# Altium project LaserDiode_Analog.PrjPcb (part 1 of 2)
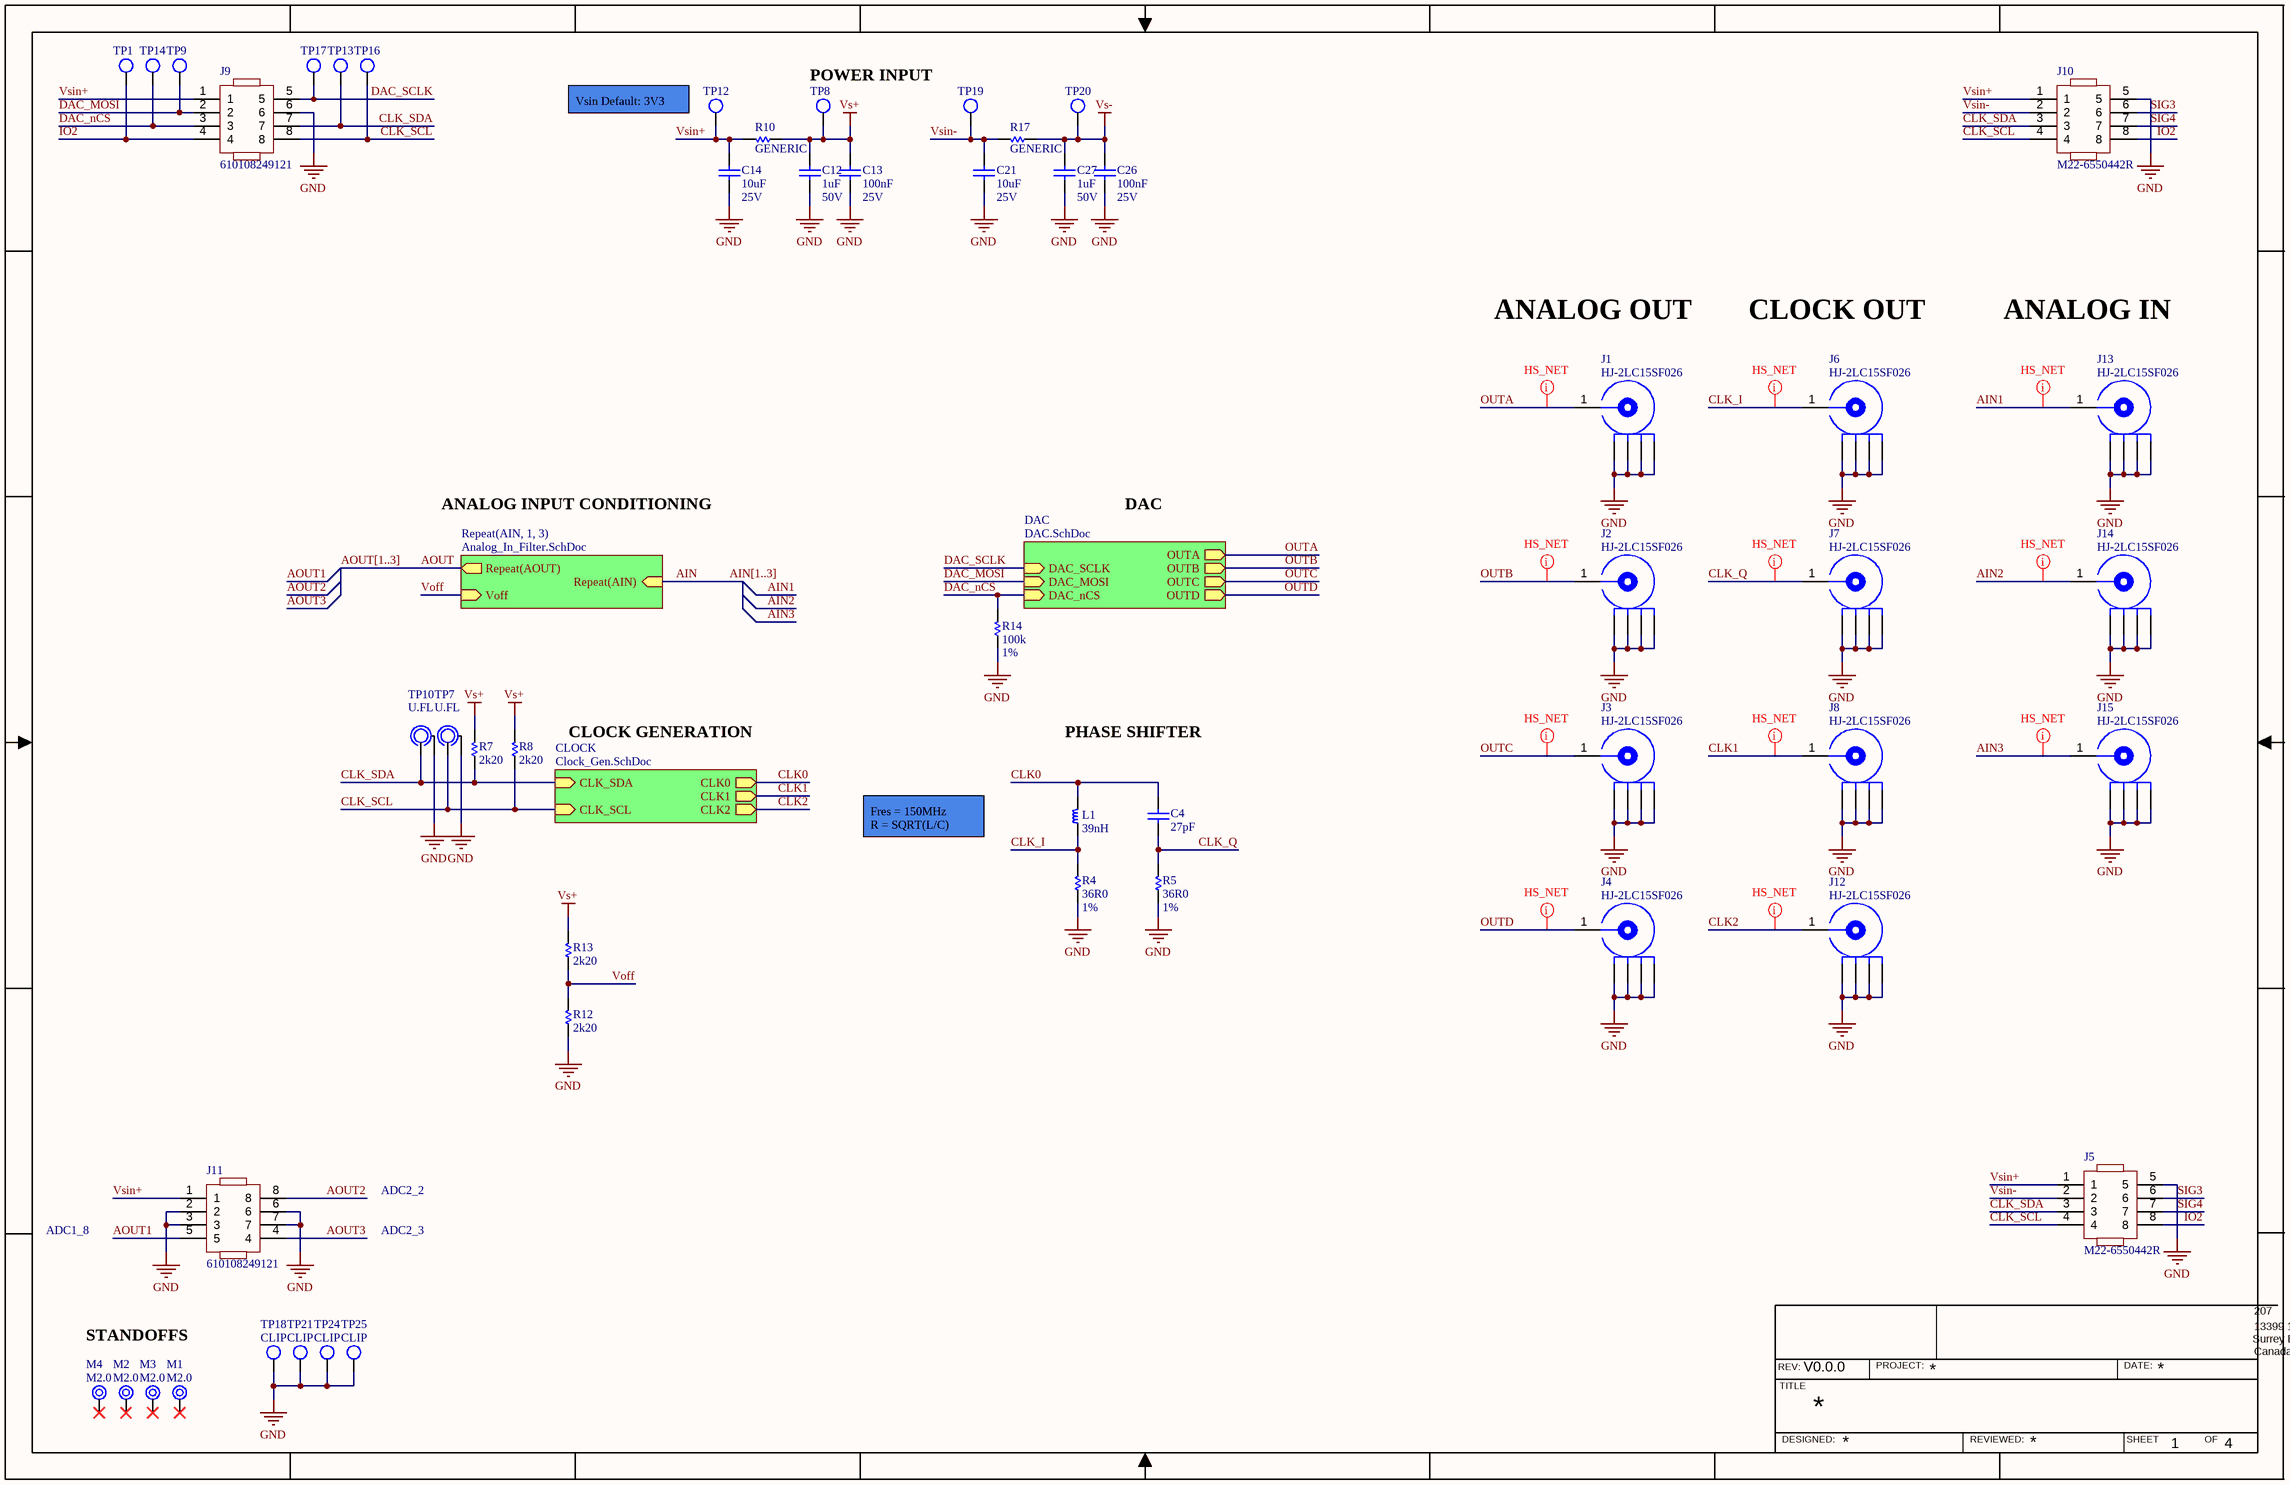
[diagram p0: LaserDiode_Analog.SchDoc]
4 sheets, 133 parts. Net scope: hierarchical (ports join the sheet entries above them; power ports are global).
Board file: LaserDiode_Analog.PcbDoc
Sheets:
  LaserDiode_Analog.SchDoc
    DAC = DAC.SchDoc
    AIN1 = Analog_In_Filter.SchDoc
    AIN2 = Analog_In_Filter.SchDoc
    AIN3 = Analog_In_Filter.SchDoc
    CLOCK = Clock_Gen.SchDoc

## Sheet LaserDiode_Analog.SchDoc
size 431 x 279 mm; Organization: ORGANIZATION; Address1: 207; Address2: 13399 104 Ave; Address3: Surrey BC, V3T 0C9; Address4: Canada; Revision: V0.0.0; SheetNumber: 1; SheetTotal: 4; ENG_APP_DATE: --/--/--; DSN_APP_DATE: --/--/--; CHK_APP_DATE: --/--/--

### Parts
C4  27pF  [C0402]
C12  1uF  Voltage Rating: 50V  [c0603]
C13  100nF  Voltage Rating: 25V  [C0402]
C14  10uF  Voltage Rating: 25V  [c0805]
C21  10uF  Voltage Rating: 25V  [c0805]
C26  100nF  Voltage Rating: 25V  [C0402]
C27  1uF  Voltage Rating: 50V  [c0603]
J1  HJ-2LC15SF026  [SMA TH RA BORE]
J2  HJ-2LC15SF026  [SMA TH RA BORE]
J3  HJ-2LC15SF026  [SMA TH RA BORE]
J4  HJ-2LC15SF026  [SMA TH RA BORE]
J5  M22-6550442R  [CONN HDR 08 FEMALE RA 2ROW]
J6  HJ-2LC15SF026  [SMA TH RA BORE]
J7  HJ-2LC15SF026  [SMA TH RA BORE]
J8  HJ-2LC15SF026  [SMA TH RA BORE]
J9  610108249121  [CONN HDR 08 MALE RA 2ROW - duplicate]
J10  M22-6550442R  [CONN HDR 08 FEMALE RA 2ROW]
J11  610108249121  [CONN HDR 08 MALE RA 2ROW - duplicate]
J12  HJ-2LC15SF026  [SMA TH RA BORE]
J13  HJ-2LC15SF026  [SMA TH RA BORE]
J14  HJ-2LC15SF026  [SMA TH RA BORE]
J15  HJ-2LC15SF026  [SMA TH RA BORE]
L1  39nH  [L0402]
M1  M2.0  [MECH M2.0 UNPLATED]  (no BOM)
M2  M2.0  [MECH M2.0 UNPLATED]  (no BOM)
M3  M2.0  [MECH M2.0 UNPLATED]  (no BOM)
M4  M2.0  [MECH M2.0 UNPLATED]  (no BOM)
R4  36R0  Tolerance: 1%  [R0402]
R5  36R0  Tolerance: 1%  [R0402]
R7  2k20  [R0402]
R8  2k20  [R0402]
R10  GENERIC  [R0603]
R12  2k20  [R0402]
R13  2k20  [R0402]
R14  100k  Tolerance: 1%  [r0402]
R17  GENERIC  [R0603]
TP1  1mm  [TESTPOINT_SMT]  (value not drawn)  (no BOM)
TP7  U.FL  [U.FL]
TP8  1mm  [TESTPOINT_SMT]  (value not drawn)  (no BOM)
TP9  1mm  [TESTPOINT_SMT]  (value not drawn)  (no BOM)
TP10  U.FL  [U.FL]
TP12  1mm  [TESTPOINT_SMT]  (value not drawn)  (no BOM)
TP13  1mm  [TESTPOINT_SMT]  (value not drawn)  (no BOM)
TP14  1mm  [TESTPOINT_SMT]  (value not drawn)  (no BOM)
TP16  1mm  [TESTPOINT_SMT]  (value not drawn)  (no BOM)
TP17  1mm  [TESTPOINT_SMT]  (value not drawn)  (no BOM)
TP18  CLIP  [TESTPOINT_CLIP_1206]
TP19  1mm  [TESTPOINT_SMT]  (value not drawn)  (no BOM)
TP20  1mm  [TESTPOINT_SMT]  (value not drawn)  (no BOM)
TP21  CLIP  [TESTPOINT_CLIP_1206]
TP24  CLIP  [TESTPOINT_CLIP_1206]
TP25  CLIP  [TESTPOINT_CLIP_1206]

### Sub-sheets
CLOCK = Clock_Gen.SchDoc: CLK0 (out), CLK1 (out), CLK2 (out), CLK_SCL (in), CLK_SDA (in)
DAC = DAC.SchDoc: OUTA (out), OUTB (out), OUTC (out), OUTD (out), DAC_SCLK (in), DAC_MOSI (in), DAC_nCS (in)
Repeat(AIN, 1, 3) = Analog_In_Filter.SchDoc: Repeat(AOUT) (out), Repeat(AIN) (in), Voff (in)

### Nets
GND: C12.1 C13.1 C14.1 C21.1 C26.1 C27.1 J1.0 J2.0 J3.0 J4.0 J5.5 J6.0 J7.0 J8.0 J9.6 J10.5 J11.2 J11.3 J11.6 J11.7 J12.0 J13.0 J14.0 J15.0 R4.1 R5.1 R12.1 R14.1 TP7.0 TP10.0 TP18.1 TP21.1 TP24.1 TP25.1
Vs+: C12.2 C13.2 R7.2 R8.2 R10.1 R13.2 TP8.1
Vs-: C26.2 C27.2 R17.1 TP20.1
AIN: sheet Repeat(AIN, 1, 3)/Repeat(AIN)
AIN1: J13.1
AIN2: J14.1
AIN3: J15.1
AOUT: sheet Repeat(AIN, 1, 3)/Repeat(AOUT)
AOUT1: J11.5
AOUT2: J11.8
AOUT3: J11.4
CLK0: C4.2 L1.1 ; sheet CLOCK/CLK0
CLK1: J8.1 ; sheet CLOCK/CLK1
CLK2: J12.1 ; sheet CLOCK/CLK2
CLK_I: J6.1 L1.2 R4.2
CLK_Q: C4.1 J7.1 R5.2
CLK_SCL: J5.4 J9.8 J10.4 R8.1 TP7.1 TP16.1 ; sheet CLOCK/CLK_SCL
CLK_SDA: J5.3 J9.7 J10.3 R7.1 TP10.1 TP13.1 ; sheet CLOCK/CLK_SDA
DAC_MOSI: J9.2 TP9.1 ; sheet DAC/DAC_MOSI
DAC_nCS: J9.3 R14.2 TP14.1 ; sheet DAC/DAC_nCS
DAC_SCLK: J9.5 TP17.1 ; sheet DAC/DAC_SCLK
IO2: J5.8 J9.4 J10.8 TP1.1
OUTA: J1.1 ; sheet DAC/OUTA
OUTB: J2.1 ; sheet DAC/OUTB
OUTC: J3.1 ; sheet DAC/OUTC
OUTD: J4.1 ; sheet DAC/OUTD
SIG3: J5.6 J10.6
SIG4: J5.7 J10.7
Voff: R12.2 R13.1 ; sheet Repeat(AIN, 1, 3)/Voff
Vsin+: C14.2 J5.1 J9.1 J10.1 J11.1 R10.2 TP12.1
Vsin-: C21.2 J5.2 J10.2 R17.2 TP19.1

Not connected (* = marked no-connect by the designer): M1 1*; M2 1*; M3 1*; M4 1*

### Buses and harness runs
bus AIN[1..3]
bus AOUT[1..3]

### Layout directives
net class HS_NET; rule Clearance Constraint [Generic clearance = 10mil, and 30 value(s) for objects]; rule Impedance Constraint [Min = 42.50    Max = 57.50    ]: AIN1, AIN2, AIN3, CLK1, CLK2, CLK_I, CLK_Q, OUTA, OUTB, OUTC, OUTD

### Notes on the sheet
- (near TP8) POWER INPUT
- (near TP12) Vsin Default: 3V3
- ANALOG OUT
- CLOCK OUT
- ANALOG IN
- ANALOG INPUT CONDITIONING
- DAC
- CLOCK GENERATION
- PHASE SHIFTER
- Fres = 150MHz
  R = SQRT(L/C)
- ADC1_8
- ADC2_2
- ADC2_3
- STANDOFFS
- REV:
- PROJECT:
- DATE:
- TITLE
- SHEET
- OF
- DESIGNED:
- REVIEWED:

### Library data of the parts
C4 = CAP CER 27pF 50V C0G 0402: 贴片陶瓷电容  27pF ±5% 50V C0G(NP0) 0402; Manufacturer: Samsung; Manufacturer Part Number: CL05C270JB5NNNC; Material: Ceramic; Temperature Coefficient: 300ppm/°C; Supplier 1: RSComponents; RoHS: Yes; Category: Ceramic Capacitors; Stock 1: 1; Pricing 1: 10000=0.00700, 30000=0.00700, 50000=0.00500, 100000=0.00500, 250000=0.00400 (USD); Mount: Surface Mount; Case/Package: 0402; Case Code (Metric): 1005; Case Code (Imperial): 0402; Contact Plating: Tin; Min Operating Temperature: -55°C; Max Operating Temperature: 125°C; Capacitance: 27pF; Tolerance: 5%; Packaging: Tape and Reel; Package Quantity: 1; Voltage Rating: 50V; Dielectric: C0G; Voltage: 50V; Series: CL; Voltage Rating (DC): 50V; Length: 1mm; Width: 0.02inch; Height: 0.5mm; Thickness: 0.022inch; Depth: 0.5mm; Radiation Hardening: No; RoHS Compliant: Yes; Lead Free: Lead Free; ComponentLink1URL: https://datasheet.ciiva.com/25806/cl05c270jb5nnnc-25806401.pdf?src-supplier=Digi-Key; ComponentLink1Description: https://datasheet.ciiva.com/25806/cl05c270jb5nnnc-25806401.pdf?src-supplier=Digi-Key; ComponentLink2URL: https://datasheet.ciiva.com/26838/getdatasheetpartid-359687-26838295.pdf?src-supplier=Verical; ComponentLink2Description: https://datasheet.ciiva.com/26838/getdatasheetpartid-359687-26838295.pdf?src-supplier=Verical; ComponentLink3URL: https://datasheet.ciiva.com/29198/458634-da-01-en-vs-kondensator-0402-29198410.pdf?src-supplier=Conrad; ComponentLink3Description: https://datasheet.ciiva.com/29198/458634-da-01-en-vs-kondensator-0402-29198410.pdf?src-supplier=Conrad; ComponentLink4URL: https://datasheet.ciiva.com/16391/cl05b104kq5nnnc-16391291.pdf?src-supplier=Future+Electronics; ComponentLink4Description: https://datasheet.ciiva.com/16391/cl05b104kq5nnnc-16391291.pdf?src-supplier=Future+Electronics; Supplier Part Number 1: 7661429
C12 C27 = CAP CER 1uF 50V X5R 0603: Multilayer Ceramic Capacitors (High dielectric type), 50V, 1 uF, ± 10 %, 0603, X5R, RoHS; Manufacturer: Taiyo Yuden; Manufacturer Part Number: UMK107BJ105KA-T; Tolerance: 10%; Supplier 1: Digi-Key; RoHS: Yes; Category: Ceramic Capacitors; Stock 1: 955108; Pricing 1: 1=0.19000, 10=0.12900, 50=0.07760, 100=0.06560, 500=0.04484, 1000=0.03968 (USD); Mount: Surface Mount; Case/Package: 0603; Number of Pins: 2; Case Code (Metric): 1608; Case Code (Imperial): 0603; Contact Plating: Nickel; Min Operating Temperature: -55°C; Max Operating Temperature: 85°C; Capacitance: 1uF; Packaging: Tape and Reel; Package Quantity: 1; Dielectric: X5R; Voltage Rating (DC): 50V; Termination: SMD/SMT; Series: M; Construction: Flat; Length: 1.6mm; Width: 0.031inch; Height: 0.8mm; Depth: 0.8mm; Thickness: 0.035inch; Radiation Hardening: No; RoHS Compliant: Yes; REACH SVHC: Unknown; Halogen Free: Halogen Free; ComponentLink1URL: https://datasheet.ciiva.com/134/umk107bj105ka-t-ss-134740.pdf?src-supplier=Digi-Key; ComponentLink1Description: https://datasheet.ciiva.com/134/umk107bj105ka-t-ss-134740.pdf?src-supplier=Digi-Key; ComponentLink2URL: https://datasheet.ciiva.com/11601/umk107bj105ka-t-ss-11601811.pdf?src-supplier=Avnet; ComponentLink2Description: https://datasheet.ciiva.com/11601/umk107bj105ka-t-ss-11601811.pdf?src-supplier=Avnet; ComponentLink3URL: https://datasheet.ciiva.com/5744/1697715-5744913.pdf?src-supplier=Farnell; ComponentLink3Description: https://datasheet.ciiva.com/5744/1697715-5744913.pdf?src-supplier=Farnell; ComponentLink4URL: https://datasheet.ciiva.com/30199/43umk107bj105ka-t-30199791.pdf?src-supplier=Onlinecomponents.com; ComponentLink4Description: https://datasheet.ciiva.com/30199/43umk107bj105ka-t-30199791.pdf?src-supplier=Onlinecomponents.com; ComponentLink5URL: https://datasheet.ciiva.com/15922/336umk107bj105ka-t-15922611.pdf?src-supplier=Onlinecomponents.com; ComponentLink5Description: https://datasheet.ciiva.com/15922/336umk107bj105ka-t-15922611.pdf?src-supplier=Onlinecomponents.com; ComponentLink6URL: https://datasheet.ciiva.com/5427/mlcc-all-e-541559-5427036.pdf?src-supplier=Mouser; ComponentLink6Description: https://datasheet.ciiva.com/5427/mlcc-all-e-541559-5427036.pdf?src-supplier=Mouser; ComponentLink7URL: https://datasheet.ciiva.com/7975/mlcc-all-e-7975898.pdf?src-supplier=Element14; ComponentLink7Description: https://datasheet.ciiva.com/7975/mlcc-all-e-7975898.pdf?src-supplier=Element14; ComponentLink8URL: https://datasheet.ciiva.com/7975/1697715-7975608.pdf?src-supplier=Element14; ComponentLink8Description: https://datasheet.ciiva.com/7975/1697715-7975608.pdf?src-supplier=Element14; ComponentLink9URL: https://datasheet.ciiva.com/22694/1697715-22694278.pdf?src-supplier=Element14; ComponentLink9Description: https://datasheet.ciiva.com/22694/1697715-22694278.pdf?src-supplier=Element14; Supplier Part Number 1: 587-2400-1-ND
C13 C26 = CAP CER 100nF 25V X5R 0402: Cap Ceramic 0.1uF 25V X5R 10% Pad SMD 0402 85¡ãC T/R / Multi Layer Ceramic Capacitor (MLCC); Manufacturer: Samsung; Manufacturer Part Number: CL05A104KA5NNNC; Supplier 1: Digi-Key; RoHS: Yes; Category: Ceramic Capacitors; Stock 1: 8053194; Pricing 1: 1=0.10000, 10=0.01100, 50=0.00600, 100=0.00490, 500=0.00346, 1000=0.00272, 2500=0.00248, 5000=0.00228 (USD); Mount: Surface Mount; Case/Package: 0402; Case Code (Metric): 1005; Case Code (Imperial): 0402; Min Operating Temperature: -55°C; Max Operating Temperature: 85°C; Capacitance: 100nF; Tolerance: 10%; Dielectric: X5R; Packaging: Tape and Reel; Package Quantity: 1; Voltage: 25V; Series: CL; Construction: Flat; Voltage Rating (DC): 25V; Length: 1mm; Width: 0.02inch; Height: 0.5mm; Thickness: 0.022inch; Depth: 0.5mm; Radiation Hardening: No; Lead Free: Lead Free; ComponentLink1URL: https://datasheet.ciiva.com/25802/cl05a104ka5nnnc-25802704.pdf?src-supplier=Digi-Key; ComponentLink1Description: https://datasheet.ciiva.com/25802/cl05a104ka5nnnc-25802704.pdf?src-supplier=Digi-Key; ComponentLink2URL: https://datasheet.ciiva.com/26838/getdatasheetpartid-357412-26838142.pdf?src-supplier=Verical; ComponentLink2Description: https://datasheet.ciiva.com/26838/getdatasheetpartid-357412-26838142.pdf?src-supplier=Verical; ComponentLink3URL: https://datasheet.ciiva.com/16437/cl05a104ka5nnnc-16437369.pdf?src-supplier=Future+Electronics; ComponentLink3Description: https://datasheet.ciiva.com/16437/cl05a104ka5nnnc-16437369.pdf?src-supplier=Future+Electronics; ComponentLink4URL: https://datasheet.ciiva.com/26309/mlcc-catalogdownload2013-eng-26309014.pdf?src-supplier=Distrelec; ComponentLink4Description: https://datasheet.ciiva.com/26309/mlcc-catalogdownload2013-eng-26309014.pdf?src-supplier=Distrelec; Supplier Part Number 1: 1276-1043-1-ND
C14 C21 = CAP CER 10uF 25V X5R 0805: Cap Ceramic 10uF 25V X5R 10% SMD 0805 85°C Embossed T/R; Manufacturer: Samsung; Manufacturer Part Number: CL21A106KAYNNNE; Supplier 1: Digi-Key; RoHS: Yes; Category: Ceramic Capacitors; Stock 1: 2266338; Pricing 1: 2000=0.03549, 4000=0.03247 (USD); Mount: Surface Mount; Case/Package: 0805; Case Code (Metric): 2012; Case Code (Imperial): 0805; Min Operating Temperature: -55°C; Max Operating Temperature: 85°C; Package Quantity: 1; Packaging: Tape and Reel; Capacitance: 10uF; Tolerance: 10%; Dielectric: X5R; Series: CL; Construction: Flat; Length: 2mm; Width: 0.049inch; Height: 1.25mm; Depth: 1.25mm; Thickness: 0.057inch; Radiation Hardening: No; RoHS Compliant: Yes; ComponentLink1URL: https://datasheet.ciiva.com/25796/cl21a106kaynnne-25796720.pdf?src-supplier=Digi-Key; ComponentLink1Description: https://datasheet.ciiva.com/25796/cl21a106kaynnne-25796720.pdf?src-supplier=Digi-Key; ComponentLink2URL: https://datasheet.ciiva.com/26838/getdatasheetpartid-357558-26838583.pdf?src-supplier=Verical; ComponentLink2Description: https://datasheet.ciiva.com/26838/getdatasheetpartid-357558-26838583.pdf?src-supplier=Verical; Supplier Part Number 1: 1276-2891-2-ND
J1-J4 J6-J8 J12-J15 = CON SMA BORE SMD RA HJ-2LC15SF026
J5 J10 = CONN HDR 08 FEMALE RA 2 ROW: Conn Socket Strip RCP 8 POS 2mm Solder RA SMD T/R; Manufacturer: Harwin; Connector Type: Receptacle,Forked; Number of Positions: 8; Current Rating: 2A; Supplier 1: Newark; Manufacturer Part Number: M22-6550442R; RoHS: Yes; Category: Connectors; Stock 1: 750; Pricing 1: 1=1.17000, 100=0.91900, 250=0.84000, 500=0.76600, 1000=0.71200 (USD); Mount: Surface Mount; Contact Plating: Gold; Contact Material: Bronze; Insulation Color: Black; Insulation Material: Polymer; Contact Shape: Square; Min Operating Temperature: -40°C; Max Operating Temperature: 105°C; Fastening Type: Push,Pull; Packaging: Cut Tape; Number of Rows: 2; Termination: Solder; Flammability Rating: UL94 V-0; RoHS Compliant: Yes; ComponentLink1URL: https://cdn.harwin.com/pdfs/M22-655R.pdf?src-supplier=Digi-Key; ComponentLink1Description: https://cdn.harwin.com/pdfs/M22-655R.pdf?src-supplier=Digi-Key; Supplier Part Number 1: 45AJ6425
J9 J11 = CONN HDR 08 MALE RA 2 ROW: SMT Angled Pin Header WR-PHD, Pitch 2.54 mm, Dual Row, 8 pins; Manufacturer: Wurth Electronics; Current Rating: 3A; Number of Positions: 8; Gender: Male; Voltage Rating: 250V; Pitch: 0.1inch; Supplier 1: Newark; Manufacturer Part Number: 610108249121; RoHS: Yes; Category: Connectors; Stock 1: 350; Pricing 1: 1=1.53000, 10=1.52000, 25=1.49000, 50=1.46000, 100=1.36000 (USD); Mount: Surface Mount; Number of Pins: 8; Contact Material: Copper Alloy; Color: Black; Contact Plating: Gold; Contact Shape: Square; Contact Finish - Mating: GOLD; Insulation Material: Nylon; Insulation Color: Black; Packaging: Cut Tape; Number of Rows: 2; Termination: Solder; Number of Contacts: 8; Connector Type: Header; Fastening Type: Pull; Series: WR-PHD; Contact Type: Male Pin; Row Spacing: 0.1inch; Contact Mating Length: 0.236inch; RoHS Compliant: Yes; Flammability Rating: UL94 V-0; ComponentLink1URL: http://www.farnell.com/cad/1889791.pdf?src-supplier=Element14; ComponentLink1Description: http://www.farnell.com/cad/1889791.pdf?src-supplier=Element14; ComponentLink2URL: https://katalog.we-online.de/em/datasheet/6101xx249121.pdf?src-supplier=Digi-Key; ComponentLink2Description: https://katalog.we-online.de/em/datasheet/6101xx249121.pdf?src-supplier=Digi-Key; ComponentLink3URL: https://www.distrelec.bizhttp://katalog.we-online.de/em/datasheet/6101xx249121.pdf?mime=application%2Fpdf&src-supplier=Distrelec; ComponentLink3Description: https://www.distrelec.bizhttp://katalog.we-online.de/em/datasheet/6101xx249121.pdf?mime=application%2Fpdf&src-supplier=Distrelec; Supplier Part Number 1: 72Y1215
L1 = IND HF 39nH 5% 150mA 1R2 0402: Inductor RF Chip Multi-Layer 0.039uH 5% 100MHz 8Q-Factor Ceramic 0.15A 1.2Ohm DCR 0402 T/R; Manufacturer 1: Johanson; Manufacturer Part Number 1: L-07C39NJV6T; Category 1: Fixed Inductors; Shielding: Unshielded; Q Factor: 8; Current Rating: 150mA; DC Resistance (DCR): 1.2R; Self Resonant Frequency: 1.4GHz; Supplier 1: Arrow Electronics; Supplier Part Number 1: L-07C39NJV6T; RoHS 1: Yes; Description 1: Inductor RF Chip Multi-Layer 0.039uH 5% 100MHz 8Q-Factor Ceramic 0.15A 1.2Ohm DCR 0402 T/R; Stock 1: 27840; Pricing 1: 1=0.09800, 10=0.04660, 25=0.04150, 100=0.03100, 250=0.02700, 500=0.02460, 1000=0.02080, 3000=0.01830, 6000=0.01810, 15000=0.01450 (USD); Mounting Technology: Surface Mount; Case/Package: 0402; Pins: 2; Case Code (Metric): 1005; Case Code (Imperial): 0402; Core Material: Ceramic; Min Operating Temperature: -40°C; Max Operating Temperature: 100°C; Tolerance: 5%; Packaging: Tape and Reel; Package Quantity: 1; Inductance Tolerance: 5%; Value: 39nH; Max DC Current: 150mA; Termination: SMD/SMT; Test Frequency: 100MHz; Resistor Type: Ceramic; DC Current: 150mA; Series: -; Length: 0.039inch; Width: 0.5mm; Height: 0.5mm; Height - Seated (Max): 0.024inch; Depth: 0.6mm; Reach SVHC Compliant: Yes; Military Standard: Not; RoHS Compliant: Yes; ComponentLink1URL: http://components.arrow.com/part/dataview/43912024S9160734N2069?src-supplier=Arrow+Electronics; ComponentLink1Description: http://components.arrow.com/part/dataview/43912024S9160734N2069?src-supplier=Arrow+Electronics; ComponentLink2URL: http://www.farnell.com/datasheets/1327494.pdf?src-supplier=Farnell; ComponentLink2Description: http://www.farnell.com/datasheets/1327494.pdf?src-supplier=Farnell; ComponentLink3URL: http://www.mouser.com/ds/2/611/JTI_CAT_2012_Inductors_Chip-242427.pdf?src-supplier=Mouser; ComponentLink3Description: http://www.mouser.com/ds/2/611/JTI_CAT_2012_Inductors_Chip-242427.pdf?src-supplier=Mouser; ComponentLink4URL: https://www.johansontechnology.com/downloads/jti-cat-rf-ind.pdf?src-supplier=Digi-Key; ComponentLink4Description: https://www.johansontechnology.com/downloads/jti-cat-rf-ind.pdf?src-supplier=Digi-Key; ComponentLink5URL: http://www.johansontechnology.com/downloads/jti-cat-rf-ind.pdf?src-supplier=Digi-Key; ComponentLink5Description: http://www.johansontechnology.com/downloads/jti-cat-rf-ind.pdf?src-supplier=Digi-Key; ComponentLink6URL: http://www.farnell.com/datasheets/1327494.pdf?src-supplier=Element14; ComponentLink6Description: http://www.farnell.com/datasheets/1327494.pdf?src-supplier=Element14
M1-M4 = MECH M2.0 UNPLATED
R4 R5 = RES 36R0 1% 63mW 0402: Res Thick Film 0402 36 Ohm 1% 0.063W(1/16W) ±100ppm/°C Pad SMD T/R; Manufacturer 1: Yageo; Manufacturer Part Number 1: RC0402FR-0736RL; Category 1: Chip SMD Resistors; Value: 36R; Power Rating: 63mW; Voltage Rating: 50V; Supplier 1: Future Electronics; Supplier Part Number 1: 7671472; RoHS 1: Yes; Description 1: Res Thick Film 0402 36 Ohm 1% 0.063W(1/16W) ±100ppm/°C Pad SMD T/R; Stock 1: 580000; Pricing 1: 10000=0.00100, 50000=0.00100, 300000=0.00090, 1000000=0.00090, 3000000=0.00080 (USD); Case/Package: 0402; Case Code (Imperial): 0402; Case Code (Metric): 1005; Min Operating Temperature: -55°C; Max Operating Temperature: 155°C; Packaging: Tape and Reel; Termination: SMD/SMT; Resistor Type: Thick Film; Temperature Coefficient: 100ppm/°C; Voltage Rating (DC): 50V; Working Voltage: 50V; Number of Terminations: 2; Features: Moisture Resistant; Series: RC; Max Power Dissipation: 63mW; Construction: Rectangular; Resistance Tolerance: 1%; Technology: THICK FILM; Length: 1mm; Width: 0.5mm; Height: 0.35mm; Depth: 0.5mm; Military Standard: Not; Lead Free: Lead Free; RoHS Compliant: Yes; ComponentLink1URL: https://datasheet.ciiva.com/7849/1018594-7849974.pdf?src-supplier=Element14; ComponentLink1Description: https://datasheet.ciiva.com/7849/1018594-7849974.pdf?src-supplier=Element14; ComponentLink2URL: https://datasheet.ciiva.com/7849/1018594-7849975.pdf?src-supplier=Element14; ComponentLink2Description: https://datasheet.ciiva.com/7849/1018594-7849975.pdf?src-supplier=Element14; ComponentLink3URL: https://datasheet.ciiva.com/16743/pyu-rc0402-51-rohs-l-6-r-16743934.pdf?src-supplier=Future+Electronics; ComponentLink3Description: https://datasheet.ciiva.com/16743/pyu-rc0402-51-rohs-l-6-r-16743934.pdf?src-supplier=Future+Electronics
R7 R8 R12 R13 = RES 2k20 1% 63mW 0402: 贴片电阻 2200Ω ± 1.00% 0.0625W ± 100ppm/℃ 0402; Manufacturer: Yageo; Manufacturer Part Number: RC0402FR-072K2L; Resistance: 2.2kR; Tolerance: 1%; Power Rating: 63mW; Voltage Rating: 50V; Temperature Coefficient: 100ppm/°C; Supplier 1: RSComponents; RoHS: Yes; Category: Chip SMD Resistors; Stock 1: 10500; Pricing 1: 10000=0.00300 (GBP); Case/Package: 0402; Case Code (Imperial): 0402; Case Code (Metric): 1005; Weight: 2.3E-05oz; Size Code: 0402; Min Operating Temperature: -55°C; Max Operating Temperature: 155°C; Resistor Type: Thick Film; Packaging: Tape and Reel; Termination: SMD/SMT; Features: Moisture Resistant; Series: RC; Max Power Dissipation: 63mW; Number of Terminations: 2; Resistance Tolerance: 1%; Construction: Rectangular; Technology: THICK FILM; Length: 1mm; Width: 0.5mm; Height: 0.35mm; Depth: 0.5mm; RoHS Compliant: Yes; REACH SVHC: Unknown; Military Standard: Not; Lead Free: Lead Free; ComponentLink1URL: https://datasheet.ciiva.com/11808/0900766b80c66297-11808786.pdf?src-supplier=RSComponents; ComponentLink1Description: https://datasheet.ciiva.com/11808/0900766b80c66297-11808786.pdf?src-supplier=RSComponents; ComponentLink2URL: https://datasheet.ciiva.com/7983/1018594-7983515.pdf?src-supplier=Element14; ComponentLink2Description: https://datasheet.ciiva.com/7983/1018594-7983515.pdf?src-supplier=Element14; ComponentLink3URL: https://datasheet.ciiva.com/46383/1018594-46383563.pdf?src-supplier=Element14; ComponentLink3Description: https://datasheet.ciiva.com/46383/1018594-46383563.pdf?src-supplier=Element14; ComponentLink4URL: https://datasheet.ciiva.com/12577/pyu-rc0402-51-rohs-l-6-r-12577429.pdf?src-supplier=Mouser; ComponentLink4Description: https://datasheet.ciiva.com/12577/pyu-rc0402-51-rohs-l-6-r-12577429.pdf?src-supplier=Mouser; ComponentLink5URL: https://datasheet.ciiva.com/7849/1018594-7849929.pdf?src-supplier=Element14; ComponentLink5Description: https://datasheet.ciiva.com/7849/1018594-7849929.pdf?src-supplier=Element14; ComponentLink6URL: https://datasheet.ciiva.com/7849/1018594-7849928.pdf?src-supplier=Element14; ComponentLink6Description: https://datasheet.ciiva.com/7849/1018594-7849928.pdf?src-supplier=Element14; ComponentLink7URL: https://datasheet.ciiva.com/16741/pyu-rc0402-51-rohs-l-6-r-16741015.pdf?src-supplier=Future+Electronics; ComponentLink7Description: https://datasheet.ciiva.com/16741/pyu-rc0402-51-rohs-l-6-r-16741015.pdf?src-supplier=Future+Electronics; Supplier Part Number 1: 1987730
R10 R17 = RES GENERIC 0603
R14 = RES 100k 1% 63mW 0402: Res Thick Film 0402 100K Ohm 1% 0.063W ±100ppm/°C Molded SMD Paper T/R; Manufacturer: Stackpole Electronics; Manufacturer Part Number: RMCF0402FT100K; Resistance: 100kR; Power Rating: 62.5mW; Max Power Dissipation: 63mW; Supplier 1: Avnet; RoHS: Yes; Category: Chip SMD Resistors; Stock 1: 3260000; Pricing 1: 10000=0.00170, 20000=0.00168, 40000=0.00163, 60000=0.00160, 80000=0.00154, 100000=0.00150, 1000000=0.00146 (USD); Mount: Surface Mount; Case/Package: 0402; Case Code (Metric): 1005; Case Code (Imperial): 0402; Contact Plating: Tin,Matte; Size Code: 0402; Min Operating Temperature: -55°C; Max Operating Temperature: 155°C; Packaging: Tape and Reel; Resistor Type: Thick Film; Number of Terminations: 2; Temperature Coefficient: 100ppm/°C; Features: Automotive AEC-Q200; Series: RMCF; Construction: Rectangular; Length: 1mm; Width: 0.02inch; Height: 0.016inch; Depth: 0.5mm; Radiation Hardening: No; Military Standard: Not; Lead Free: Lead Free; RoHS Compliant: Yes; ComponentLink1URL: https://datasheet.ciiva.com/15193/getdatasheetpartid-482656-15193415.pdf?src-supplier=Verical; ComponentLink1Description: https://datasheet.ciiva.com/15193/getdatasheetpartid-482656-15193415.pdf?src-supplier=Verical; Supplier Part Number 1: RMCF0402FT100K
TP1 TP8 TP9 TP12-TP14 TP16 TP17 TP19 TP20 = TP 1mm: SMT testpoint
TP7 TP10 = TP U.FL: CONN U.FL RCPT STR 50 OHM SMD; Manufacturer: Hirose; Manufacturer Part Number: U.FL-R-SMT-1(80); Body Material: Bronze; Body Plating: Silver; Center Contact Plating: Gold; Dielectric Material: Polymer; Connector Type: Receptacle,Male Pin; Impedance: 50R; Max Frequency: 6GHz; Number of Ports: 1; Mating Cycles: 30; Supplier 1: Future Electronics; RoHS: Yes; Category: RF / Coaxial Connectors; Stock 1: 40000; Pricing 1: 10000=0.81500, 20000=0.80000, 30000=0.78500 (USD); Mount: Surface Mount; Case/Package: SMD/SMT; Contact Material: Brass; Housing Color: Beige; Min Operating Temperature: -40°C; Max Operating Temperature: 90°C; Package Quantity: 10000; Packaging: Tape and Reel; Fastening Type: SNAP-ON; Series: U.FL; Termination: Solder; Lead Free: Lead Free; RoHS Compliant: Yes; ComponentLink1URL: http://www.mouser.com/ds/2/185/U.FL_catalog-939761.pdf?src-supplier=Mouser; ComponentLink1Description: http://www.mouser.com/ds/2/185/U.FL_catalog-939761.pdf?src-supplier=Mouser; ComponentLink2URL: https://www.hirose.com/product/en/download_file/key_name/U.FL-R-SMT-1%2880%29/category/Specification%20Sheet/doc_file_id/37638/?file_category_id=9&item_id=03310472280&is_series=&src-supplier=Digi-Key; ComponentLink2Description: https://www.hirose.com/product/en/download_file/key_name/U.FL-R-SMT-1%2880%29/category/Specification%20Sheet/doc_file_id/37638/?file_category_id=9&item_id=03310472280&is_series=&src-supplier=Digi-Key
TP18 TP21 TP24 TP25 = TP CLIP 1206 RCWCTE: Current Sense Resistors - SMD CHIP CHECKER HT=2.0 1206; Manufacturer: KOA Speer; Manufacturer Part Number: RCWCTE; Resistance: 0R; Current Rating: 2A; Supplier 1: Digi-Key; RoHS: Yes; Category: Chip SMD Resistors; Stock 1: 282207; Pricing 1: 1=0.16000, 10=0.13700, 25=0.12120, 50=0.11320, 100=0.10500, 250=0.09292, 500=0.08888, 1000=0.07272 (USD); Mount: Surface Mount; Case/Package: 1206; Case Code (Imperial): 1206; Case Code (Metric): 3216; Min Operating Temperature: -55°C; Max Operating Temperature: 125°C; Packaging: Tape and Reel; Termination: SMD/SMT; Series: RC; Length: 3.2mm; Width: 1.6mm; Height: 2mm; Depth: 1.6mm; Military Standard: Not; RoHS Compliant: Yes; ComponentLink1URL: https://datasheet.ciiva.com/34302/1876186-34302940.pdf?src-supplier=Jameco; ComponentLink1Description: https://datasheet.ciiva.com/34302/1876186-34302940.pdf?src-supplier=Jameco; ComponentLink2URL: https://datasheet.ciiva.com/5556/rc-5556236.pdf?src-supplier=Mouser; ComponentLink2Description: https://datasheet.ciiva.com/5556/rc-5556236.pdf?src-supplier=Mouser; ComponentLink3URL: https://datasheet.ciiva.com/26821/getdatasheetpartid-110197-26821157.pdf?src-supplier=Verical; ComponentLink3Description: https://datasheet.ciiva.com/26821/getdatasheetpartid-110197-26821157.pdf?src-supplier=Verical; Supplier Part Number 1: 2019-RCWCTECT-ND

## Sheet DAC.SchDoc
size 431 x 279 mm; PartNumber: PNXXXXXXX; Organization: ORGANIZATION; Address1: 207; Address2: 13399 104 Ave; Address3: Surrey BC, V3T 0C9; Address4: Canada; Revision: V0.0.0; SheetNumber: 2; SheetTotal: 4; ENG_APP_DATE: --/--/--; DSN_APP_DATE: --/--/--; CHK_APP_DATE: --/--/--
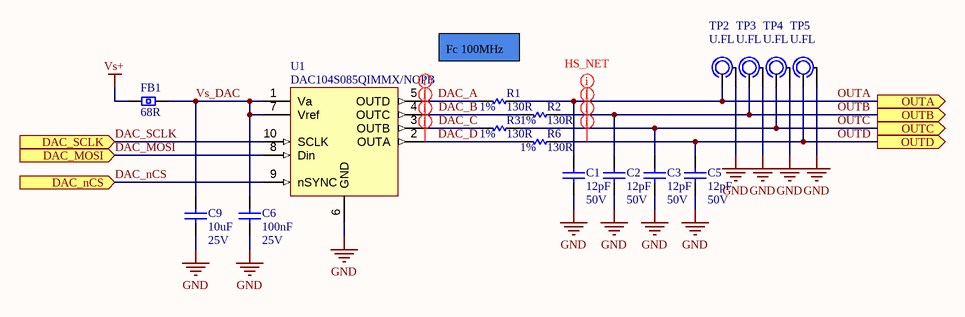
[diagram p1: DAC.SchDoc]

### Parts
C1  12pF  Voltage: 50V  [C0402]
C2  12pF  Voltage: 50V  [C0402]
C3  12pF  Voltage: 50V  [C0402]
C5  12pF  Voltage: 50V  [C0402]
C6  100nF  Voltage Rating: 25V  [C0402]
C9  10uF  Voltage Rating: 25V  [c0805]
FB1  68R  [FB0402]
R1  130R  Tolerance: 1%  [R0402]
R2  130R  Tolerance: 1%  [R0402]
R3  130R  Tolerance: 1%  [R0402]
R6  130R  Tolerance: 1%  [R0402]
TP2  U.FL  [U.FL]
TP3  U.FL  [U.FL]
TP4  U.FL  [U.FL]
TP5  U.FL  [U.FL]
U1  DAC104S085QIMMX/NOPB  [TSSOP50P490X110-10N]

### Ports
DAC_MOSI (in), DAC_nCS (in), DAC_SCLK (in), OUTA (out), OUTB (out), OUTC (out), OUTD (out)

### Nets
GND: C1.1 C2.1 C3.1 C5.1 C6.2 C9.1 TP2.0 TP3.0 TP4.0 TP5.0 U1.6(GND)
Vs+: FB1.2
DAC_A: R1.2 U1.5(OUTD)
DAC_B: R2.2 U1.4(OUTC)
DAC_C: R3.2 U1.3(OUTB)
DAC_D: R6.2 U1.2(OUTA)
DAC_MOSI: U1.8(Din) ; port DAC_MOSI
DAC_nCS: U1.9(nSYNC) ; port DAC_nCS
DAC_SCLK: U1.10(SCLK) ; port DAC_SCLK
OUTA: C1.2 R1.1 TP2.1 ; port OUTA
OUTB: C2.2 R2.1 TP3.1 ; port OUTB
OUTC: C3.2 R3.1 TP4.1 ; port OUTC
OUTD: C5.2 R6.1 TP5.1 ; port OUTD
Vs_DAC: C6.1 C9.2 FB1.1 U1.1(Va) U1.7(Vref)

### Layout directives
net class HS_NET; rule Clearance Constraint [Generic clearance = 10mil, and 30 value(s) for objects]; rule Impedance Constraint [Min = 42.50    Max = 57.50    ]: DAC_A, DAC_B, DAC_C, DAC_D, OUTA, OUTB, OUTC, OUTD

### Notes on the sheet
- Fc 100MHz
- REV:
- PROJECT:
- DATE:
- TITLE
- SHEET
- OF
- DESIGNED:
- REVIEWED:

### Library data of the parts
C1-C3 C5 = CAP CER 12pF 50V C0G 0402: Ceramic capacitor SMD-0402 12pF /50V C0G# J +-5%, Samsung, RoHS; Manufacturer Part Number: CL05C120JB5NNNC; Tolerance: 5%; Dielectric: C0G; Temperature Coefficient: 300ppm/°C; Supplier 1: Digi-Key; Manufacturer: Samsung; RoHS: Yes; Category: Ceramic Capacitors; Stock 1: 41998; Pricing 1: 10000=0.00386, 20000=0.00367 (USD); Mount: Surface Mount; Case/Package: 0402; Case Code (Metric): 1005; Case Code (Imperial): 0402; Material: Ceramic; Contact Plating: Tin; Min Operating Temperature: -55°C; Max Operating Temperature: 125°C; Capacitance: 12pF; Package Quantity: 1; Packaging: Tape and Reel; Voltage Rating: 50V; Series: CL; Construction: Flat; Voltage Rating (DC): 50V; Length: 1mm; Width: 0.02inch; Height: 0.5mm; Thickness: 0.022inch; Depth: 0.5mm; Radiation Hardening: No; RoHS Compliant: Yes; Lead Free: Lead Free; ComponentLink1URL: https://datasheet.ciiva.com/25806/cl05c120jb5nnnc-25806484.pdf?src-supplier=Digi-Key; ComponentLink1Description: https://datasheet.ciiva.com/25806/cl05c120jb5nnnc-25806484.pdf?src-supplier=Digi-Key; ComponentLink2URL: https://datasheet.ciiva.com/26838/getdatasheetpartid-658047-26838280.pdf?src-supplier=Verical; ComponentLink2Description: https://datasheet.ciiva.com/26838/getdatasheetpartid-658047-26838280.pdf?src-supplier=Verical; ComponentLink3URL: https://datasheet.ciiva.com/29198/458703-da-01-en-vs-kondensator-0402-29198421.pdf?src-supplier=Conrad; ComponentLink3Description: https://datasheet.ciiva.com/29198/458703-da-01-en-vs-kondensator-0402-29198421.pdf?src-supplier=Conrad; ComponentLink4URL: https://datasheet.ciiva.com/16449/cl05b104kq5nnnc-16449055.pdf?src-supplier=Future+Electronics; ComponentLink4Description: https://datasheet.ciiva.com/16449/cl05b104kq5nnnc-16449055.pdf?src-supplier=Future+Electronics; Supplier Part Number 1: 1276-1178-2-ND
C6 = CAP CER 100nF 25V X5R 0402: as C13 on sheet LaserDiode_Analog; Supplier 1: Digi-Key; RoHS: Yes; Category: Ceramic Capacitors; Stock 1: 8053194; Pricing 1: 1=0.10000, 10=0.01100, 50=0.00600, 100=0.00490, 500=0.00346, 1000=0.00272, 2500=0.00248, 5000=0.00228 (USD); Mount: Surface Mount; Case/Package: 0402; Case Code (Metric): 1005; Case Code (Imperial): 0402; Min Operating Temperature: -55°C; Max Operating Temperature: 85°C; Capacitance: 100nF; Tolerance: 10%; Dielectric: X5R; Packaging: Tape and Reel; Package Quantity: 1; Voltage: 25V; Series: CL; Construction: Flat; Voltage Rating (DC): 25V; Length: 1mm; Width: 0.02inch; Height: 0.5mm; Thickness: 0.022inch; Depth: 0.5mm; Radiation Hardening: No; Lead Free: Lead Free; ComponentLink1URL: https://datasheet.ciiva.com/25802/cl05a104ka5nnnc-25802704.pdf?src-supplier=Digi-Key; ComponentLink1Description: https://datasheet.ciiva.com/25802/cl05a104ka5nnnc-25802704.pdf?src-supplier=Digi-Key; ComponentLink2URL: https://datasheet.ciiva.com/26838/getdatasheetpartid-357412-26838142.pdf?src-supplier=Verical; ComponentLink2Description: https://datasheet.ciiva.com/26838/getdatasheetpartid-357412-26838142.pdf?src-supplier=Verical; ComponentLink3URL: https://datasheet.ciiva.com/16437/cl05a104ka5nnnc-16437369.pdf?src-supplier=Future+Electronics; ComponentLink3Description: https://datasheet.ciiva.com/16437/cl05a104ka5nnnc-16437369.pdf?src-supplier=Future+Electronics; ComponentLink4URL: https://datasheet.ciiva.com/26309/mlcc-catalogdownload2013-eng-26309014.pdf?src-supplier=Distrelec; ComponentLink4Description: https://datasheet.ciiva.com/26309/mlcc-catalogdownload2013-eng-26309014.pdf?src-supplier=Distrelec; Supplier Part Number 1: 1276-1043-1-ND
C9 = CAP CER 10uF 25V X5R 0805: as C14 on sheet LaserDiode_Analog; Supplier 1: Digi-Key; RoHS: Yes; Category: Ceramic Capacitors; Stock 1: 2266338; Pricing 1: 2000=0.03549, 4000=0.03247 (USD); Mount: Surface Mount; Case/Package: 0805; Case Code (Metric): 2012; Case Code (Imperial): 0805; Min Operating Temperature: -55°C; Max Operating Temperature: 85°C; Package Quantity: 1; Packaging: Tape and Reel; Capacitance: 10uF; Tolerance: 10%; Dielectric: X5R; Series: CL; Construction: Flat; Length: 2mm; Width: 0.049inch; Height: 1.25mm; Depth: 1.25mm; Thickness: 0.057inch; Radiation Hardening: No; RoHS Compliant: Yes; ComponentLink1URL: https://datasheet.ciiva.com/25796/cl21a106kaynnne-25796720.pdf?src-supplier=Digi-Key; ComponentLink1Description: https://datasheet.ciiva.com/25796/cl21a106kaynnne-25796720.pdf?src-supplier=Digi-Key; ComponentLink2URL: https://datasheet.ciiva.com/26838/getdatasheetpartid-357558-26838583.pdf?src-supplier=Verical; ComponentLink2Description: https://datasheet.ciiva.com/26838/getdatasheetpartid-357558-26838583.pdf?src-supplier=Verical; Supplier Part Number 1: 1276-2891-2-ND
FB1 = FB 68R 400mA 310mR 0402: Ferrite Beads Multi-Layer 68Ohm 25% 100MHz 400mA 310mOhm DCR 0402 T/R; Manufacturer: Taiyo Yuden; Manufacturer Part Number: BK1005LL680-T; DC Resistance (DCR): 310mR; Number of Lines: 1; Shielding: Unshielded; Supplier 1: Digi-Key; RoHS: Yes; Category: Ferrite Beads and Chips; Stock 1: 9707; Pricing 1: 1=0.10000, 10=0.04100, 25=0.03640, 50=0.03300, 100=0.02970, 250=0.02176, 500=0.01584, 1000=0.01551, 5000=0.01056 (USD); Mount: Surface Mount; Case/Package: 0402; Number of Pins: 2; Case Code (Metric): 1005; Case Code (Imperial): 0402; Core Material: Ferrite; Min Operating Temperature: -55°C; Max Operating Temperature: 125°C; Packaging: Tape and Reel; Package Quantity: 1; Impedance: 68R; Tolerance: 25%; Max DC Current: 400mA; Termination: SMD/SMT; Test Frequency: 100MHz; Max Current Rating: 400mA; Series: BK; Frequency: 100MHz; Length: 0.039inch; Width: 0.02inch; Height: 0.022inch; Depth: 0.55mm; Halogen Free: Halogen Free; Lead Free: Lead Free; REACH SVHC: Unknown; ComponentLink1URL: https://datasheet.ciiva.com/1013/bk1005ll680-t-ss-1013936.pdf?src-supplier=Digi-Key; ComponentLink1Description: https://datasheet.ciiva.com/1013/bk1005ll680-t-ss-1013936.pdf?src-supplier=Digi-Key; ComponentLink2URL: https://datasheet.ciiva.com/1013/mlci07-e-1013935.pdf?src-supplier=Digi-Key; ComponentLink2Description: https://datasheet.ciiva.com/1013/mlci07-e-1013935.pdf?src-supplier=Digi-Key; ComponentLink3URL: https://datasheet.ciiva.com/1013/mlci07-e-1013937.pdf?src-supplier=Digi-Key; ComponentLink3Description: https://datasheet.ciiva.com/1013/mlci07-e-1013937.pdf?src-supplier=Digi-Key; Supplier Part Number 1: 587-1860-1-ND
R1-R3 R6 = RES 130R 1% 63mW 0402: Res General Purpose Thick Film 0402 130 Ohm 1% 1/16W ±100ppm/°C Molded SMD Paper T/R; Manufacturer 1: Yageo; Manufacturer Part Number 1: RC0402FR-07130RL; Category 1: Chip SMD Resistors; Power Rating: 62.5mW; Voltage Rating: 50V; Max Power Dissipation: 63mW; Supplier 1: Future Electronics; Supplier Part Number 1: 7796683; RoHS 1: Yes; Description 1: Res General Purpose Thick Film 0402 130 Ohm 1% 1/16W ±100ppm/°C Molded SMD Paper T/R; Stock 1: 330000; Pricing 1: 10000=0.00100, 50000=0.00090, 100000=0.00090, 300000=0.00080, 1000000=0.00080, 1250000=0.00080, 3000000=0.00070 (USD); Case/Package: 0402; Case Code (Metric): 1005; Case Code (Imperial): 0402; Min Operating Temperature: -55°C; Max Operating Temperature: 155°C; Value: 130R; Packaging: Tape and Reel; Package Quantity: 1; Resistor Type: Thick Film; Number of Terminations: 2; Termination: SMD/SMT; Temperature Coefficient: 100ppm/°C; Features: Moisture Resistant; Series: RC; Construction: Rectangular; Length: 1mm; Width: 0.02inch; Height: 0.016inch; Depth: 0.5mm; Military Standard: Not; Lead Free: Lead Free; RoHS Compliant: Yes; ComponentLink1URL: https://datasheet.ciiva.com/2519/pyu-r-int-thick-7-2519049.pdf?src-supplier=Digi-Key; ComponentLink1Description: https://datasheet.ciiva.com/2519/pyu-r-int-thick-7-2519049.pdf?src-supplier=Digi-Key; ComponentLink2URL: https://datasheet.ciiva.com/16744/pyu-rc0402-51-rohs-l-6-r-16744959.pdf?src-supplier=Future+Electronics; ComponentLink2Description: https://datasheet.ciiva.com/16744/pyu-rc0402-51-rohs-l-6-r-16744959.pdf?src-supplier=Future+Electronics; ComponentLink3URL: https://datasheet.ciiva.com/15189/getdatasheetpartid-327831-15189351.pdf?src-supplier=Verical; ComponentLink3Description: https://datasheet.ciiva.com/15189/getdatasheetpartid-327831-15189351.pdf?src-supplier=Verical; ComponentLink4URL: https://datasheet.ciiva.com/2519/pyu-r-int-thick-7-2519050.pdf?src-supplier=Digi-Key; ComponentLink4Description: https://datasheet.ciiva.com/2519/pyu-r-int-thick-7-2519050.pdf?src-supplier=Digi-Key; ComponentLink5URL: https://datasheet.ciiva.com/2519/pyu-r-int-thick-7-2519048.pdf?src-supplier=Digi-Key; ComponentLink5Description: https://datasheet.ciiva.com/2519/pyu-r-int-thick-7-2519048.pdf?src-supplier=Digi-Key; ComponentLink6URL: https://datasheet.ciiva.com/12666/pyu-rc0402-51-rohs-l-6-r-12666955.pdf?src-supplier=Mouser; ComponentLink6Description: https://datasheet.ciiva.com/12666/pyu-rc0402-51-rohs-l-6-r-12666955.pdf?src-supplier=Mouser
TP2-TP5 = TP U.FL: as TP7 on sheet LaserDiode_Analog; Supplier 1: Future Electronics; RoHS: Yes; Category: RF / Coaxial Connectors; Stock 1: 40000; Pricing 1: 10000=0.81500, 20000=0.80000, 30000=0.78500 (USD); Mount: Surface Mount; Case/Package: SMD/SMT; Contact Material: Brass; Housing Color: Beige; Min Operating Temperature: -40°C; Max Operating Temperature: 90°C; Package Quantity: 10000; Packaging: Tape and Reel; Fastening Type: SNAP-ON; Series: U.FL; Termination: Solder; Lead Free: Lead Free; RoHS Compliant: Yes; ComponentLink1URL: http://www.mouser.com/ds/2/185/U.FL_catalog-939761.pdf?src-supplier=Mouser; ComponentLink1Description: http://www.mouser.com/ds/2/185/U.FL_catalog-939761.pdf?src-supplier=Mouser; ComponentLink2URL: https://www.hirose.com/product/en/download_file/key_name/U.FL-R-SMT-1%2880%29/category/Specification%20Sheet/doc_file_id/37638/?file_category_id=9&item_id=03310472280&is_series=&src-supplier=Digi-Key; ComponentLink2Description: https://www.hirose.com/product/en/download_file/key_name/U.FL-R-SMT-1%2880%29/category/Specification%20Sheet/doc_file_id/37638/?file_category_id=9&item_id=03310472280&is_series=&src-supplier=Digi-Key
U1 = IC DAC 10b 4chan DAC104S085QIMMX/NOPB: DAC 4-CH Resistor-String 10-bit Automotive 10-Pin VSSOP T/R; Manufacturer 1: Texas Instruments; Category 1: Digital to Analog Converters (DACs); Nominal Supply Current: 650uA; Interface: SPI; Max Supply Voltage: 3.6V; Min Supply Voltage: 2.7V; Number of DAC Channels: 4; Resolution: 10b; Settling Time: 6us; Number of Bits: 10; Integral Nonlinearity (INL): 2LSB; Differential Nonlinearity: 0.35LSB; Power Consumption: 1.1mW; Polarity: Unipolar; Output Type: Voltage; Supplier 1: Mouser; Supplier Part Number 1: 595-C104S085QIMMXNPB; Manufacturer Part Number 1: DAC104S085QIMMX/NOPB; RoHS 1: Yes; Description 1: DAC 4-CH Resistor-String 10-bit Automotive 10-Pin VSSOP T/R; Stock 1: 1920; Pricing 1: 1=6.10000, 10=5.48000, 50=5.18000, 100=4.49000, 1000=3.34000, 10000=3.34000 (USD); Case/Package: VSSOP; Pins: 10; Min Operating Temperature: -40°C; Max Operating Temperature: 125°C; Package Quantity: 3500; Number of Converters: 4; Packaging: Tape and Reel; Output Polarity: Unipolar; Supply Current: 650uA; Series: DAC104S085-Q1; Lead Free: Lead Free; RoHS Compliant: Yes; ComponentLink1URL: http://components.arrow.com/part/dataview/57166829S421825N1317?src-supplier=Arrow+Electronics; ComponentLink1Description: http://components.arrow.com/part/dataview/57166829S421825N1317?src-supplier=Arrow+Electronics; ComponentLink2URL: http://www.ti.com/general/docs/suppproductinfo.tsp?distId=10&amp;gotoUrl=http%3A%2F%2Fwww.ti.com%2Flit%2Fgpn%2Fdac104s085-q1&src-supplier=Digi-Key; ComponentLink2Description: http://www.ti.com/general/docs/suppproductinfo.tsp?distId=10&amp;gotoUrl=http%3A%2F%2Fwww.ti.com%2Flit%2Fgpn%2Fdac104s085-q1&src-supplier=Digi-Key; ComponentLink3URL: http://www.ti.com/lit/gpn/dac104s085-q1?src-supplier=Mouser; ComponentLink3Description: http://www.ti.com/lit/gpn/dac104s085-q1?src-supplier=Mouser; ComponentLink4URL: http://www.ti.com/general/docs/lit/getliterature.tsp?genericPartNumber=DAC104S085-Q1&&fileType=pdf&src-supplier=Avnet; ComponentLink4Description: http://www.ti.com/general/docs/lit/getliterature.tsp?genericPartNumber=DAC104S085-Q1&&fileType=pdf&src-supplier=Avnet; ComponentLink5URL: http://www.ti.com/lit/ds/symlink/dac104s085-q1.pdf?src-supplier=Digi-Key; ComponentLink5Description: http://www.ti.com/lit/ds/symlink/dac104s085-q1.pdf?src-supplier=Digi-Key